# Altium schematic sheet Connectors.SchDoc
size A2; SheetNumber: 19; SheetTotal: 19
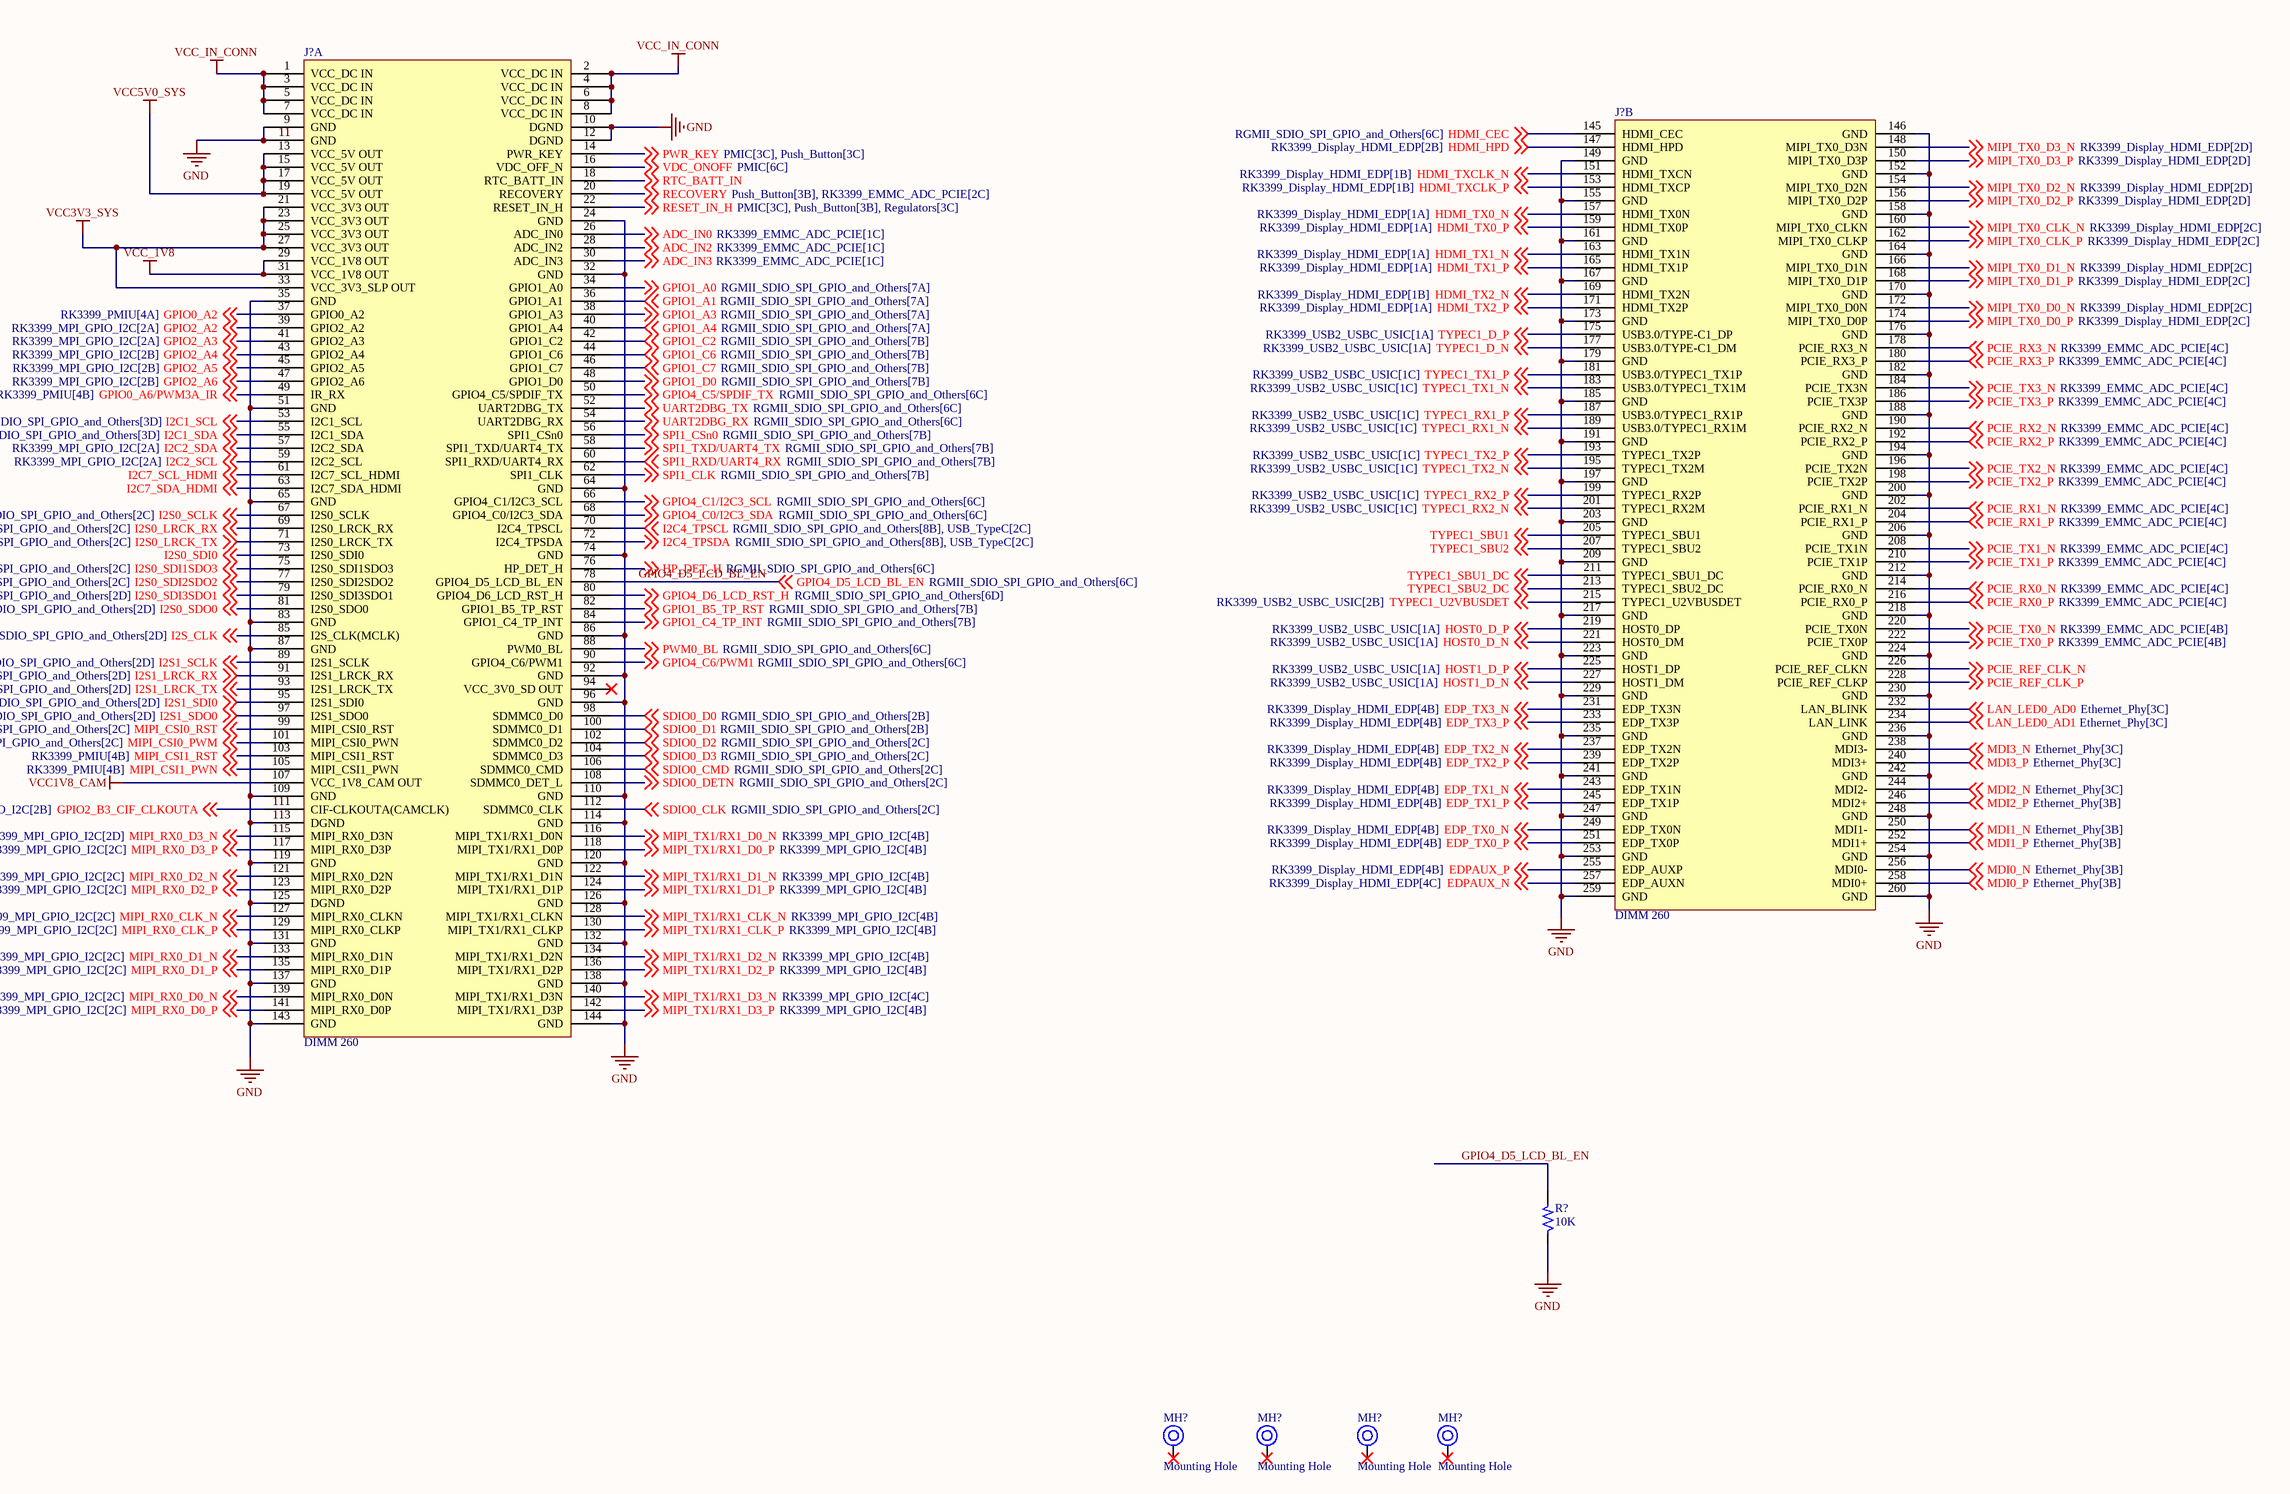
[diagram p0: Connectors.SchDoc]

## Parts
(Parts that share a designator on the sheet are numbered #1, #2 ... from top to bottom, then left to right.)
J?#1  DIMM 260  [DIMM260_DDR4]  (part A of 2)
J?#2  DIMM 260  [DIMM260_DDR4]  (part B of 2)
MH?#1  Mounting Hole  [SOM_Mounting]  (no BOM)
MH?#2  Mounting Hole  [SOM_Mounting]  (no BOM)
MH?#3  Mounting Hole  [SOM_Mounting]  (no BOM)
MH?#4  Mounting Hole  [SOM_Mounting]  (no BOM)
R?  10K  [RES_0402]

## Nets
GND: J?#1.9(GND) J?#1.10(DGND) J?#1.11(GND) J?#1.12(DGND) J?#1.24(GND) J?#1.32(GND) J?#1.35(GND) J?#1.51(GND) J?#1.64(GND) J?#1.65(GND) J?#1.74(GND) J?#1.83(GND) J?#1.86(GND) J?#1.87(GND) J?#1.92(GND) J?#1.96(GND) J?#1.109(GND) J?#1.110(GND) J?#1.113(DGND) J?#1.114(GND) J?#1.119(GND) J?#1.120(GND) J?#1.125(DGND) J?#1.126(GND) J?#1.131(GND) J?#1.132(GND) J?#1.137(GND) J?#1.138(GND) J?#1.143(GND) J?#1.144(GND) J?#2.146(GND) J?#2.149(GND) J?#2.152(GND) J?#2.155(GND) J?#2.158(GND) J?#2.161(GND) J?#2.164(GND) J?#2.167(GND) J?#2.170(GND) J?#2.173(GND) J?#2.176(GND) J?#2.179(GND) J?#2.182(GND) J?#2.185(GND) J?#2.188(GND) J?#2.191(GND) J?#2.194(GND) J?#2.197(GND) J?#2.200(GND) J?#2.203(GND) J?#2.206(GND) J?#2.209(GND) J?#2.212(GND) J?#2.217(GND) J?#2.218(GND) J?#2.223(GND) J?#2.224(GND) J?#2.229(GND) J?#2.230(GND) J?#2.235(GND) J?#2.236(GND) J?#2.241(GND) J?#2.242(GND) J?#2.247(GND) J?#2.248(GND) J?#2.253(GND) J?#2.254(GND) J?#2.259(GND) J?#2.260(GND) R?.1
VCC1V8_CAM: J?#1.107(VCC_1V8_CAM_OUT)
VCC3V3_SYS: J?#1.21(VCC_3V3_OUT) J?#1.23(VCC_3V3_OUT) J?#1.25(VCC_3V3_OUT) J?#1.27(VCC_3V3_OUT) J?#1.33(VCC_3V3_SLP_OUT)
VCC5V0_SYS: J?#1.13(VCC_5V_OUT) J?#1.15(VCC_5V_OUT) J?#1.17(VCC_5V_OUT) J?#1.19(VCC_5V_OUT)
VCC_1V8: J?#1.29(VCC_1V8_OUT) J?#1.31(VCC_1V8_OUT)
VCC_IN_CONN: J?#1.1(VCC_DC_IN) J?#1.2(VCC_DC_IN) J?#1.3(VCC_DC_IN) J?#1.4(VCC_DC_IN) J?#1.5(VCC_DC_IN) J?#1.6(VCC_DC_IN) J?#1.7(VCC_DC_IN) J?#1.8(VCC_DC_IN)
ADC_IN0: J?#1.26(ADC_IN0) ; off-sheet ADC_IN0
ADC_IN2: J?#1.28(ADC_IN2) ; off-sheet ADC_IN2
ADC_IN3: J?#1.30(ADC_IN3) ; off-sheet ADC_IN3
EDP_TX0_N: J?#2.249(EDP_TX0N) ; off-sheet EDP_TX0_N
EDP_TX0_P: J?#2.251(EDP_TX0P) ; off-sheet EDP_TX0_P
EDP_TX1_N: J?#2.243(EDP_TX1N) ; off-sheet EDP_TX1_N
EDP_TX1_P: J?#2.245(EDP_TX1P) ; off-sheet EDP_TX1_P
EDP_TX2_N: J?#2.237(EDP_TX2N) ; off-sheet EDP_TX2_N
EDP_TX2_P: J?#2.239(EDP_TX2P) ; off-sheet EDP_TX2_P
EDP_TX3_N: J?#2.231(EDP_TX3N) ; off-sheet EDP_TX3_N
EDP_TX3_P: J?#2.233(EDP_TX3P) ; off-sheet EDP_TX3_P
EDPAUX_N: J?#2.257(EDP_AUXN) ; off-sheet EDPAUX_N
EDPAUX_P: J?#2.255(EDP_AUXP) ; off-sheet EDPAUX_P
GPIO0_A2: J?#1.37(GPIO0_A2) ; off-sheet GPIO0_A2
GPIO0_A6/PWM3A_IR: J?#1.49(IR_RX) ; off-sheet GPIO0_A6/PWM3A_IR
GPIO1_A0: J?#1.34(GPIO1_A0) ; off-sheet GPIO1_A0
GPIO1_A1: J?#1.36(GPIO1_A1) ; off-sheet GPIO1_A1
GPIO1_A3: J?#1.38(GPIO1_A3) ; off-sheet GPIO1_A3
GPIO1_A4: J?#1.40(GPIO1_A4) ; off-sheet GPIO1_A4
GPIO1_B5_TP_RST: J?#1.82(GPIO1_B5_TP_RST) ; off-sheet GPIO1_B5_TP_RST
GPIO1_C2: J?#1.42(GPIO1_C2) ; off-sheet GPIO1_C2
GPIO1_C4_TP_INT: J?#1.84(GPIO1_C4_TP_INT) ; off-sheet GPIO1_C4_TP_INT
GPIO1_C6: J?#1.44(GPIO1_C6) ; off-sheet GPIO1_C6
GPIO1_C7: J?#1.46(GPIO1_C7) ; off-sheet GPIO1_C7
GPIO1_D0: J?#1.48(GPIO1_D0) ; off-sheet GPIO1_D0
GPIO2_A2: J?#1.39(GPIO2_A2) ; off-sheet GPIO2_A2
GPIO2_A3: J?#1.41(GPIO2_A3) ; off-sheet GPIO2_A3
GPIO2_A4: J?#1.43(GPIO2_A4) ; off-sheet GPIO2_A4
GPIO2_A5: J?#1.45(GPIO2_A5) ; off-sheet GPIO2_A5
GPIO2_A6: J?#1.47(GPIO2_A6) ; off-sheet GPIO2_A6
GPIO2_B3_CIF_CLKOUTA: J?#1.111(CIF-CLKOUTA(CAMCLK)) ; off-sheet GPIO2_B3_CIF_CLKOUTA
GPIO4_C0/I2C3_SDA: J?#1.68(GPIO4_C0/I2C3_SDA) ; off-sheet GPIO4_C0/I2C3_SDA
GPIO4_C1/I2C3_SCL: J?#1.66(GPIO4_C1/I2C3_SCL) ; off-sheet GPIO4_C1/I2C3_SCL
GPIO4_C5/SPDIF_TX: J?#1.50(GPIO4_C5/SPDIF_TX) ; off-sheet GPIO4_C5/SPDIF_TX
GPIO4_C6/PWM1: J?#1.90(GPIO4_C6/PWM1) ; off-sheet GPIO4_C6/PWM1
GPIO4_D5_LCD_BL_EN: J?#1.78(GPIO4_D5_LCD_BL_EN) R?.2 ; off-sheet GPIO4_D5_LCD_BL_EN
GPIO4_D6_LCD_RST_H: J?#1.80(GPIO4_D6_LCD_RST_H) ; off-sheet GPIO4_D6_LCD_RST_H
HDMI_CEC: J?#2.145(HDMI_CEC) ; off-sheet HDMI_CEC
HDMI_HPD: J?#2.147(HDMI_HPD) ; off-sheet HDMI_HPD
HDMI_TX0_N: J?#2.157(HDMI_TX0N) ; off-sheet HDMI_TX0_N
HDMI_TX0_P: J?#2.159(HDMI_TX0P) ; off-sheet HDMI_TX0_P
HDMI_TX1_N: J?#2.163(HDMI_TX1N) ; off-sheet HDMI_TX1_N
HDMI_TX1_P: J?#2.165(HDMI_TX1P) ; off-sheet HDMI_TX1_P
HDMI_TX2_N: J?#2.169(HDMI_TX2N) ; off-sheet HDMI_TX2_N
HDMI_TX2_P: J?#2.171(HDMI_TX2P) ; off-sheet HDMI_TX2_P
HDMI_TXCLK_N: J?#2.151(HDMI_TXCN) ; off-sheet HDMI_TXCLK_N
HDMI_TXCLK_P: J?#2.153(HDMI_TXCP) ; off-sheet HDMI_TXCLK_P
HOST0_D_N: J?#2.221(HOST0_DM) ; off-sheet HOST0_D_N
HOST0_D_P: J?#2.219(HOST0_DP) ; off-sheet HOST0_D_P
HOST1_D_N: J?#2.227(HOST1_DM) ; off-sheet HOST1_D_N
HOST1_D_P: J?#2.225(HOST1_DP) ; off-sheet HOST1_D_P
HP_DET_H: J?#1.76(HP_DET_H) ; off-sheet HP_DET_H
I2C1_SCL: J?#1.53(I2C1_SCL) ; off-sheet I2C1_SCL
I2C1_SDA: J?#1.55(I2C1_SDA) ; off-sheet I2C1_SDA
I2C2_SCL: J?#1.59(I2C2_SCL) ; off-sheet I2C2_SCL
I2C2_SDA: J?#1.57(I2C2_SDA) ; off-sheet I2C2_SDA
I2C4_TPSCL: J?#1.70(I2C4_TPSCL) ; off-sheet I2C4_TPSCL
I2C4_TPSDA: J?#1.72(I2C4_TPSDA) ; off-sheet I2C4_TPSDA
I2C7_SCL_HDMI: J?#1.61(I2C7_SCL_HDMI) ; off-sheet I2C7_SCL_HDMI
I2C7_SDA_HDMI: J?#1.63(I2C7_SDA_HDMI) ; off-sheet I2C7_SDA_HDMI
I2S0_LRCK_RX: J?#1.69(I2S0_LRCK_RX) ; off-sheet I2S0_LRCK_RX
I2S0_LRCK_TX: J?#1.71(I2S0_LRCK_TX) ; off-sheet I2S0_LRCK_TX
I2S0_SCLK: J?#1.67(I2S0_SCLK) ; off-sheet I2S0_SCLK
I2S0_SDI0: J?#1.73(I2S0_SDI0) ; off-sheet I2S0_SDI0
I2S0_SDI1SDO3: J?#1.75(I2S0_SDI1SDO3) ; off-sheet I2S0_SDI1SDO3
I2S0_SDI2SDO2: J?#1.77(I2S0_SDI2SDO2) ; off-sheet I2S0_SDI2SDO2
I2S0_SDI3SDO1: J?#1.79(I2S0_SDI3SDO1) ; off-sheet I2S0_SDI3SDO1
I2S0_SDO0: J?#1.81(I2S0_SDO0) ; off-sheet I2S0_SDO0
I2S1_LRCK_RX: J?#1.91(I2S1_LRCK_RX) ; off-sheet I2S1_LRCK_RX
I2S1_LRCK_TX: J?#1.93(I2S1_LRCK_TX) ; off-sheet I2S1_LRCK_TX
I2S1_SCLK: J?#1.89(I2S1_SCLK) ; off-sheet I2S1_SCLK
I2S1_SDI0: J?#1.95(I2S1_SDI0) ; off-sheet I2S1_SDI0
I2S1_SDO0: J?#1.97(I2S1_SDO0) ; off-sheet I2S1_SDO0
I2S_CLK: J?#1.85(I2S_CLK(MCLK)) ; off-sheet I2S_CLK
LAN_LED0_AD0: J?#2.232(LAN_BLINK) ; off-sheet LAN_LED0_AD0
LAN_LED0_AD1: J?#2.234(LAN_LINK) ; off-sheet LAN_LED0_AD1
MDI0_N: J?#2.256(MDI0-) ; off-sheet MDI0_N
MDI0_P: J?#2.258(MDI0+) ; off-sheet MDI0_P
MDI1_N: J?#2.250(MDI1-) ; off-sheet MDI1_N
MDI1_P: J?#2.252(MDI1+) ; off-sheet MDI1_P
MDI2_N: J?#2.244(MDI2-) ; off-sheet MDI2_N
MDI2_P: J?#2.246(MDI2+) ; off-sheet MDI2_P
MDI3_N: J?#2.238(MDI3-) ; off-sheet MDI3_N
MDI3_P: J?#2.240(MDI3+) ; off-sheet MDI3_P
MIPI_CSI0_PWM: J?#1.101(MIPI_CSI0_PWN) ; off-sheet MIPI_CSI0_PWM
MIPI_CSI0_RST: J?#1.99(MIPI_CSI0_RST) ; off-sheet MIPI_CSI0_RST
MIPI_CSI1_PWN: J?#1.105(MIPI_CSI1_PWN) ; off-sheet MIPI_CSI1_PWN
MIPI_CSI1_RST: J?#1.103(MIPI_CSI1_RST) ; off-sheet MIPI_CSI1_RST
MIPI_RX0_CLK_N: J?#1.127(MIPI_RX0_CLKN) ; off-sheet MIPI_RX0_CLK_N
MIPI_RX0_CLK_P: J?#1.129(MIPI_RX0_CLKP) ; off-sheet MIPI_RX0_CLK_P
MIPI_RX0_D0_N: J?#1.139(MIPI_RX0_D0N) ; off-sheet MIPI_RX0_D0_N
MIPI_RX0_D0_P: J?#1.141(MIPI_RX0_D0P) ; off-sheet MIPI_RX0_D0_P
MIPI_RX0_D1_N: J?#1.133(MIPI_RX0_D1N) ; off-sheet MIPI_RX0_D1_N
MIPI_RX0_D1_P: J?#1.135(MIPI_RX0_D1P) ; off-sheet MIPI_RX0_D1_P
MIPI_RX0_D2_N: J?#1.121(MIPI_RX0_D2N) ; off-sheet MIPI_RX0_D2_N
MIPI_RX0_D2_P: J?#1.123(MIPI_RX0_D2P) ; off-sheet MIPI_RX0_D2_P
MIPI_RX0_D3_N: J?#1.115(MIPI_RX0_D3N) ; off-sheet MIPI_RX0_D3_N
MIPI_RX0_D3_P: J?#1.117(MIPI_RX0_D3P) ; off-sheet MIPI_RX0_D3_P
MIPI_TX0_CLK_N: J?#2.160(MIPI_TX0_CLKN) ; off-sheet MIPI_TX0_CLK_N
MIPI_TX0_CLK_P: J?#2.162(MIPI_TX0_CLKP) ; off-sheet MIPI_TX0_CLK_P
MIPI_TX0_D0_N: J?#2.172(MIPI_TX0_D0N) ; off-sheet MIPI_TX0_D0_N
MIPI_TX0_D0_P: J?#2.174(MIPI_TX0_D0P) ; off-sheet MIPI_TX0_D0_P
MIPI_TX0_D1_N: J?#2.166(MIPI_TX0_D1N) ; off-sheet MIPI_TX0_D1_N
MIPI_TX0_D1_P: J?#2.168(MIPI_TX0_D1P) ; off-sheet MIPI_TX0_D1_P
MIPI_TX0_D2_N: J?#2.154(MIPI_TX0_D2N) ; off-sheet MIPI_TX0_D2_N
MIPI_TX0_D2_P: J?#2.156(MIPI_TX0_D2P) ; off-sheet MIPI_TX0_D2_P
MIPI_TX0_D3_N: J?#2.148(MIPI_TX0_D3N) ; off-sheet MIPI_TX0_D3_N
MIPI_TX0_D3_P: J?#2.150(MIPI_TX0_D3P) ; off-sheet MIPI_TX0_D3_P
MIPI_TX1/RX1_CLK_N: J?#1.128(MIPI_TX1/RX1_CLKN) ; off-sheet MIPI_TX1/RX1_CLK_N
MIPI_TX1/RX1_CLK_P: J?#1.130(MIPI_TX1/RX1_CLKP) ; off-sheet MIPI_TX1/RX1_CLK_P
MIPI_TX1/RX1_D0_N: J?#1.116(MIPI_TX1/RX1_D0N) ; off-sheet MIPI_TX1/RX1_D0_N
MIPI_TX1/RX1_D0_P: J?#1.118(MIPI_TX1/RX1_D0P) ; off-sheet MIPI_TX1/RX1_D0_P
MIPI_TX1/RX1_D1_N: J?#1.122(MIPI_TX1/RX1_D1N) ; off-sheet MIPI_TX1/RX1_D1_N
MIPI_TX1/RX1_D1_P: J?#1.124(MIPI_TX1/RX1_D1P) ; off-sheet MIPI_TX1/RX1_D1_P
MIPI_TX1/RX1_D2_N: J?#1.134(MIPI_TX1/RX1_D2N) ; off-sheet MIPI_TX1/RX1_D2_N
MIPI_TX1/RX1_D2_P: J?#1.136(MIPI_TX1/RX1_D2P) ; off-sheet MIPI_TX1/RX1_D2_P
MIPI_TX1/RX1_D3_N: J?#1.140(MIPI_TX1/RX1_D3N) ; off-sheet MIPI_TX1/RX1_D3_N
MIPI_TX1/RX1_D3_P: J?#1.142(MIPI_TX1/RX1_D3P) ; off-sheet MIPI_TX1/RX1_D3_P
PCIE_REF_CLK_N: J?#2.226(PCIE_REF_CLKN) ; off-sheet PCIE_REF_CLK_N
PCIE_REF_CLK_P: J?#2.228(PCIE_REF_CLKP) ; off-sheet PCIE_REF_CLK_P
PCIE_RX0_N: J?#2.214(PCIE_RX0_N) ; off-sheet PCIE_RX0_N
PCIE_RX0_P: J?#2.216(PCIE_RX0_P) ; off-sheet PCIE_RX0_P
PCIE_RX1_N: J?#2.202(PCIE_RX1_N) ; off-sheet PCIE_RX1_N
PCIE_RX1_P: J?#2.204(PCIE_RX1_P) ; off-sheet PCIE_RX1_P
PCIE_RX2_N: J?#2.190(PCIE_RX2_N) ; off-sheet PCIE_RX2_N
PCIE_RX2_P: J?#2.192(PCIE_RX2_P) ; off-sheet PCIE_RX2_P
PCIE_RX3_N: J?#2.178(PCIE_RX3_N) ; off-sheet PCIE_RX3_N
PCIE_RX3_P: J?#2.180(PCIE_RX3_P) ; off-sheet PCIE_RX3_P
PCIE_TX0_N: J?#2.220(PCIE_TX0N) ; off-sheet PCIE_TX0_N
PCIE_TX0_P: J?#2.222(PCIE_TX0P) ; off-sheet PCIE_TX0_P
PCIE_TX1_N: J?#2.208(PCIE_TX1N) ; off-sheet PCIE_TX1_N
PCIE_TX1_P: J?#2.210(PCIE_TX1P) ; off-sheet PCIE_TX1_P
PCIE_TX2_N: J?#2.196(PCIE_TX2N) ; off-sheet PCIE_TX2_N
PCIE_TX2_P: J?#2.198(PCIE_TX2P) ; off-sheet PCIE_TX2_P
PCIE_TX3_N: J?#2.184(PCIE_TX3N) ; off-sheet PCIE_TX3_N
PCIE_TX3_P: J?#2.186(PCIE_TX3P) ; off-sheet PCIE_TX3_P
PWM0_BL: J?#1.88(PWM0_BL) ; off-sheet PWM0_BL
PWR_KEY: J?#1.14(PWR_KEY) ; off-sheet PWR_KEY
RECOVERY: J?#1.20(RECOVERY) ; off-sheet RECOVERY
RESET_IN_H: J?#1.22(RESET_IN_H) ; off-sheet RESET_IN_H
RTC_BATT_IN: J?#1.18(RTC_BATT_IN) ; off-sheet RTC_BATT_IN
SDIO0_CLK: J?#1.112(SDMMC0_CLK) ; off-sheet SDIO0_CLK
SDIO0_CMD: J?#1.106(SDMMC0_CMD) ; off-sheet SDIO0_CMD
SDIO0_D0: J?#1.98(SDMMC0_D0) ; off-sheet SDIO0_D0
SDIO0_D1: J?#1.100(SDMMC0_D1) ; off-sheet SDIO0_D1
SDIO0_D2: J?#1.102(SDMMC0_D2) ; off-sheet SDIO0_D2
SDIO0_D3: J?#1.104(SDMMC0_D3) ; off-sheet SDIO0_D3
SDIO0_DETN: J?#1.108(SDMMC0_DET_L) ; off-sheet SDIO0_DETN
SPI1_CLK: J?#1.62(SPI1_CLK) ; off-sheet SPI1_CLK
SPI1_CSn0: J?#1.56(SPI1_CSn0) ; off-sheet SPI1_CSn0
SPI1_RXD/UART4_RX: J?#1.60(SPI1_RXD/UART4_RX) ; off-sheet SPI1_RXD/UART4_RX
SPI1_TXD/UART4_TX: J?#1.58(SPI1_TXD/UART4_TX) ; off-sheet SPI1_TXD/UART4_TX
TYPEC1_D_N: J?#2.177(USB3.0/TYPE-C1_DM) ; off-sheet TYPEC1_D_N
TYPEC1_D_P: J?#2.175(USB3.0/TYPE-C1_DP) ; off-sheet TYPEC1_D_P
TYPEC1_RX1_N: J?#2.189(USB3.0/TYPEC1_RX1M) ; off-sheet TYPEC1_RX1_N
TYPEC1_RX1_P: J?#2.187(USB3.0/TYPEC1_RX1P) ; off-sheet TYPEC1_RX1_P
TYPEC1_RX2_N: J?#2.201(TYPEC1_RX2M) ; off-sheet TYPEC1_RX2_N
TYPEC1_RX2_P: J?#2.199(TYPEC1_RX2P) ; off-sheet TYPEC1_RX2_P
TYPEC1_SBU1: J?#2.205(TYPEC1_SBU1) ; off-sheet TYPEC1_SBU1
TYPEC1_SBU1_DC: J?#2.211(TYPEC1_SBU1_DC) ; off-sheet TYPEC1_SBU1_DC
TYPEC1_SBU2: J?#2.207(TYPEC1_SBU2) ; off-sheet TYPEC1_SBU2
TYPEC1_SBU2_DC: J?#2.213(TYPEC1_SBU2_DC) ; off-sheet TYPEC1_SBU2_DC
TYPEC1_TX1_N: J?#2.183(USB3.0/TYPEC1_TX1M) ; off-sheet TYPEC1_TX1_N
TYPEC1_TX1_P: J?#2.181(USB3.0/TYPEC1_TX1P) ; off-sheet TYPEC1_TX1_P
TYPEC1_TX2_N: J?#2.195(TYPEC1_TX2M) ; off-sheet TYPEC1_TX2_N
TYPEC1_TX2_P: J?#2.193(TYPEC1_TX2P) ; off-sheet TYPEC1_TX2_P
TYPEC1_U2VBUSDET: J?#2.215(TYPEC1_U2VBUSDET) ; off-sheet TYPEC1_U2VBUSDET
UART2DBG_RX: J?#1.54(UART2DBG_RX) ; off-sheet UART2DBG_RX
UART2DBG_TX: J?#1.52(UART2DBG_TX) ; off-sheet UART2DBG_TX
VDC_ONOFF: J?#1.16(VDC_OFF_N) ; off-sheet VDC_ONOFF

Not connected (* = marked no-connect by the designer): J?#1 94(VCC_3V0_SD_OUT)*; MH?#1 1*; MH?#2 1*; MH?#3 1*; MH?#4 1*

## Library data of the parts
J?#1 J?#2 = CON-DIMM_260-SMD: Dimm 260 pin smd plating on pcb; Manufacturer: NA; Manufacturer Part Number: NA; Case/Package: NA; Supplier-1: NA
MH?#1-MH?#4 = MH_3.5H_6D: Manufacturer Part Number: NA; Case/Package: TH; Manufacturer: NA; Supplier-1: NA
R? = RES_10K-0.1W-1%-0402: 10 kOhms ±1% 0.1W, 1/10W Chip Resistor 0402 (1005 Metric) Anti-Sulfur Thin Film; Manufacturer: Vishay Beyschlag/Draloric/BC Components; Manufacturer Part Number: MCS04020C1002FE000; Case/Package: 0402; Supplier-1: Digikey